# EasyEDA Pro project Easyhub.epro

# Schematic Schematic1
Board Name: Board1; Create Date: 2026-01-28; Page Name: P1; Project Name: EasyHub; Schematic Name: Schematic1; Update Date: 2026-01-28; Company: EasyEDA.com; Page Size: A4; Version: V1.0
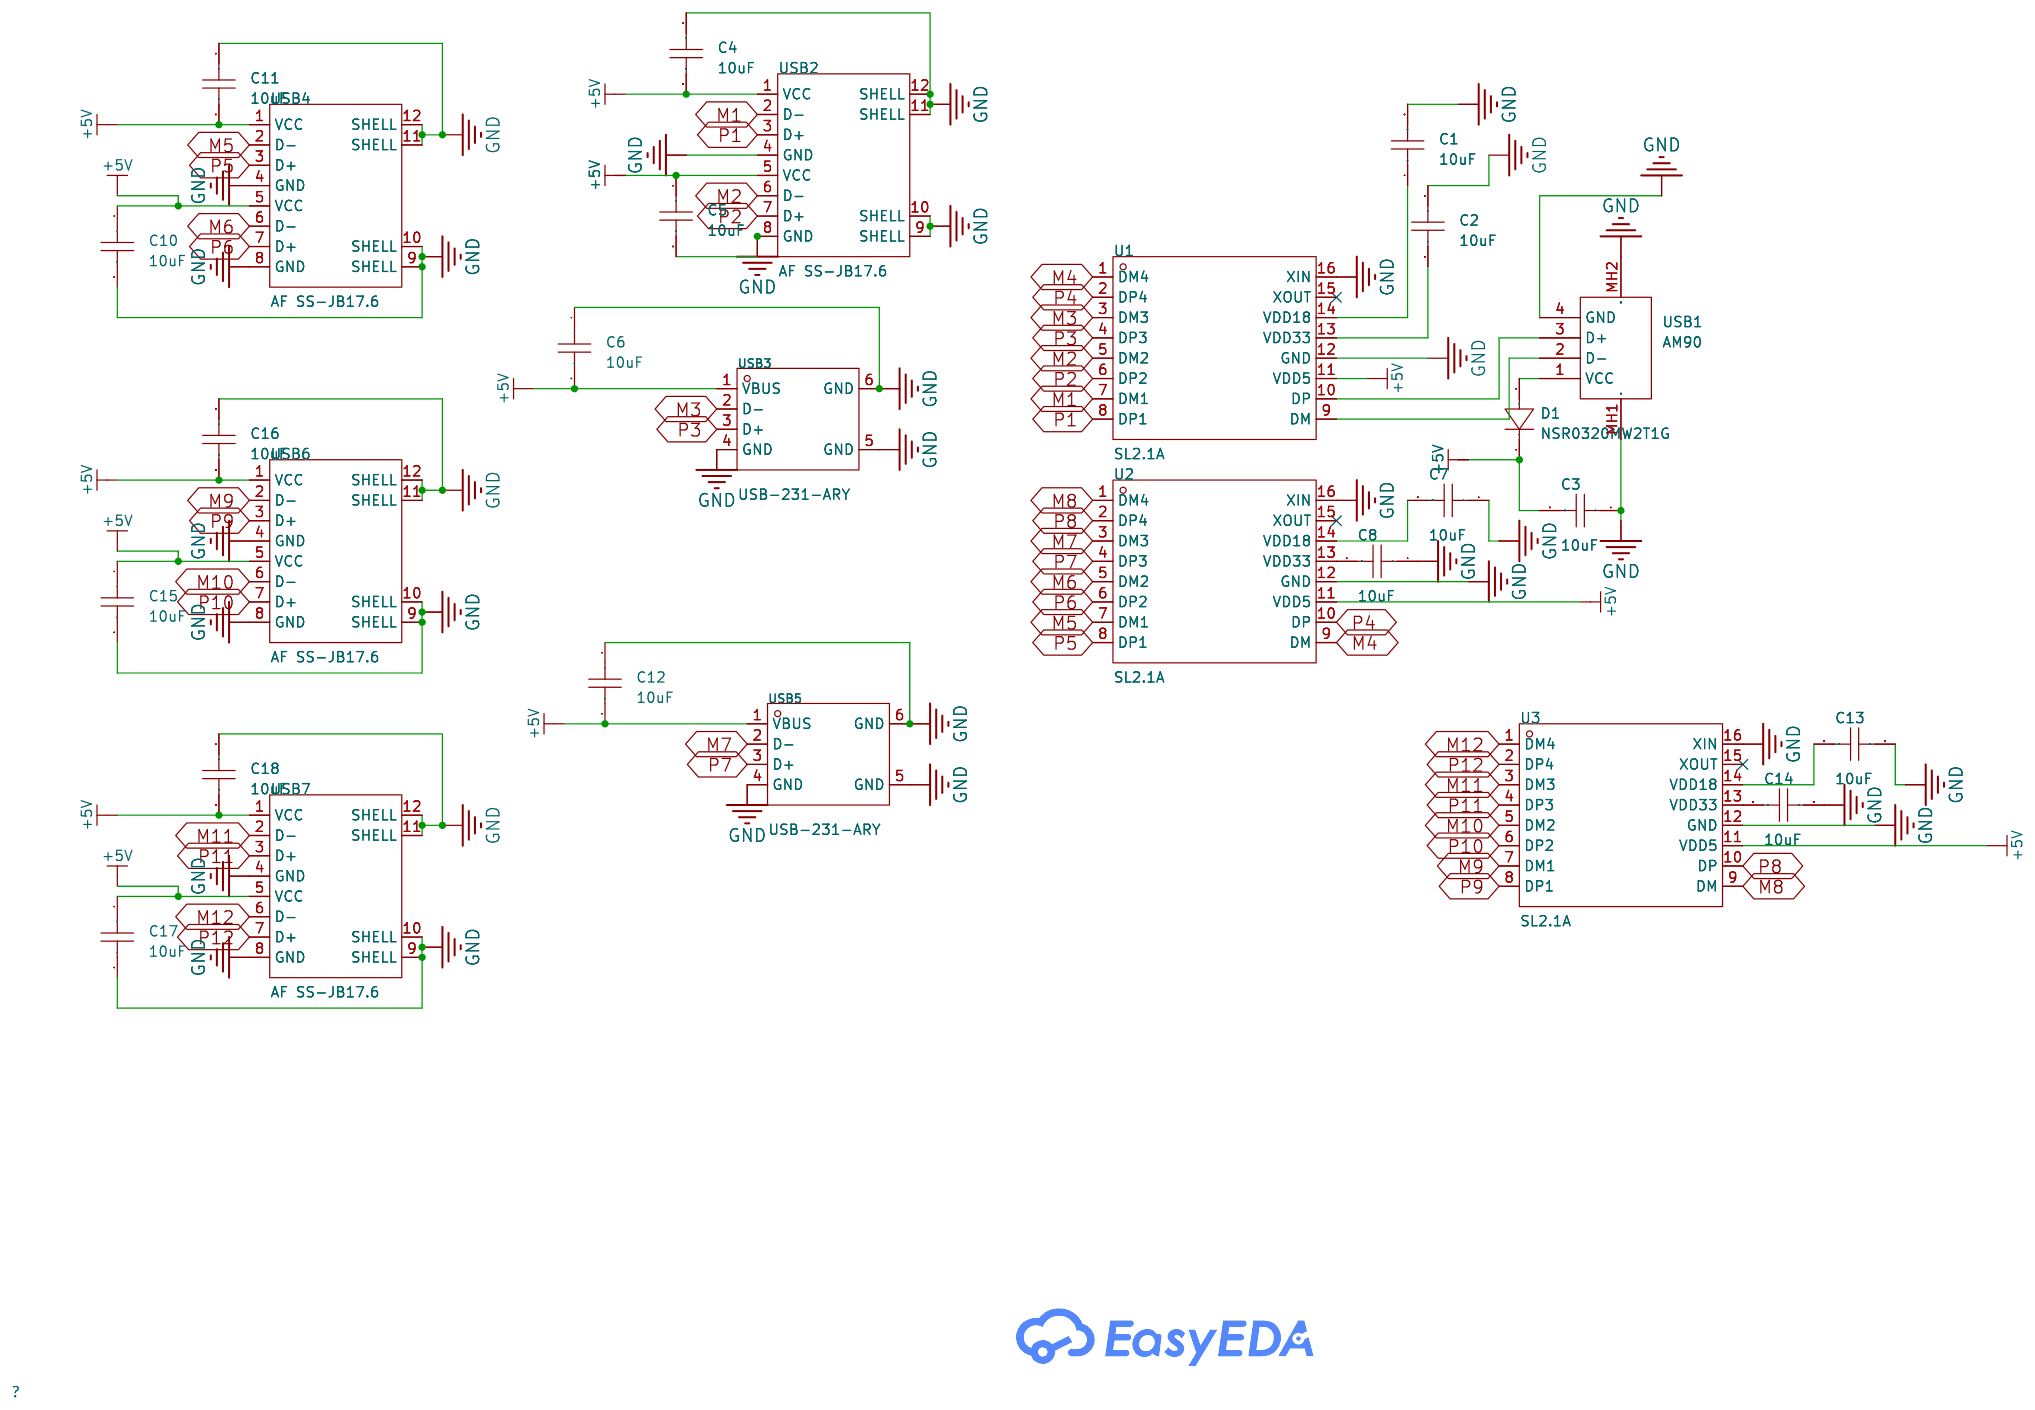
[diagram p0: schematic sheet]

## Parts
C1  10uF  [C0603]
C2  10uF  [C0603]
C3  10uF  [C0603]
C4  10uF  [C0603]
C5  10uF  [C0603]
C6  10uF  [C0603]
C7  10uF  [C0603]
C8  10uF  [C0603]
C10  10uF  [C0603]
C11  10uF  [C0603]
C12  10uF  [C0603]
C13  10uF  [C0603]
C14  10uF  [C0603]
C15  10uF  [C0603]
C16  10uF  [C0603]
C17  10uF  [C0603]
C18  10uF  [C0603]
D1  NSR0320MW2T1G  [SOD-323_L1.8-W1.3-LS2.5-RD]
U1  SL2.1A  [SOP-16_L10.0-W3.9-P1.27-LS6.0-BL]
U2  SL2.1A  [SOP-16_L10.0-W3.9-P1.27-LS6.0-BL]
U3  SL2.1A  [SOP-16_L10.0-W3.9-P1.27-LS6.0-BL]
USB1  AM90  [USB-AM-TH_AM90]
USB2  AF SS-JB17.6  [USB-A-TH_AF-SS-JB17.6]
USB3  USB-231-ARY  [USB-A-TH_USB-231-ARY]
USB4  AF SS-JB17.6  [USB-A-TH_AF-SS-JB17.6]
USB5  USB-231-ARY  [USB-A-TH_USB-231-ARY]
USB6  AF SS-JB17.6  [USB-A-TH_AF-SS-JB17.6]
USB7  AF SS-JB17.6  [USB-A-TH_AF-SS-JB17.6]

## Library data of the parts
C1-C8 C10-C18 = CL10A106KP8NNNC: Capacitance:10uF Tolerance:±10% Tolerance:±10% Voltage Rating:10V Temperature Coefficient:X5R; LCSC Part Name: 10uF ±10% 10V; Supplier Part: C19702; Manufacturer: SAMSUNG(三星); Supplier Footprint: 0603; JLCPCB Part Class: Basic Part; Datasheet: https://item.szlcsc.com/datasheet/CL10A106KP8NNNC/20411.html; Supplier: LCSC; Tolerance: ±10%; Voltage Rating: 10V; Temperature Coefficient: X5R
D1 = NSR0320MW2T1G: Voltage - Forward(Vf@If):500mV@900mA Voltage - DC Reverse(Vr):20V Current - Rectified:1A Reverse Leakage Current (Ir):50uA@15V Operating Junction Temperature Range:-55℃~+125℃ Operating Junction Temperature Range:-55℃~+125℃ Non-Repetitive Peak Forward Surg; LCSC Part Name: 电压:20V 电流:1A; Supplier Part: C48192; Manufacturer: onsemi(安森美); Supplier Footprint: SOD-323; JLCPCB Part Class: Extended Part; Datasheet: https://item.szlcsc.com/datasheet/NSR0320MW2T1G/49199.html; Supplier: LCSC; Voltage - Forward(Vf@If): 500mV@900mA; Voltage - DC Reverse(Vr): 20V; Current - Rectified: 1A; Reverse Leakage Current (Ir): 50uA@15V; Operating Junction Temperature Range: -55℃~+125℃; Non-Repetitive Peak Forward Surge Current: 5A
U1-U3 = SL2.1A_C6798314: Supplier Part: C6798314; Manufacturer: CoreChips(和芯润德); Supplier Footprint: SOP-16; JLCPCB Part Class: Extended Part; Datasheet: https://item.szlcsc.com/datasheet/SL2.1A/7757919.html; Supplier: LCSC
USB1 = AM90: Connector Type:Type-A Protocol Standard:USB 2.0 Gender:Male Mounting Type:Right Angle Number of Contacts:4P Number of Ports:1 Current Rating-Power:1.5A Voltage Rating:30V Connect-Disconnect Life:5,000 times Supplementary Features:- Center Height:- Length:; LCSC Part Name: Type-A弯插公头; Supplier Part: C404965; Manufacturer: SHOU HAN(首韩); Supplier Footprint: 弯插; JLCPCB Part Class: Extended Part; Datasheet: https://item.szlcsc.com/datasheet/AM90/392530.html; Supplier: LCSC; Connector Type: Type-A; Protocol Standard: USB 2.0; Gender: Male; Mounting Type: Right Angle; Number of Contacts: 4P; Number of Ports: 1; Current Rating-Power: 1.5A; Voltage Rating: 30V; Connect-Disconnect Life: 5,000 times; Length: 18.8mm; Detection color: White; Operating Temperature: -25℃~+85℃
USB2 USB4 USB6 USB7 = AF SS-JB17.6: Connector Type:Type-A Protocol Standard:USB 2.0 Gender:Female Mounting Type:Right Angle Number of Contacts:4Px2 Number of Ports:2 Current Rating-Power:1.5A Voltage Rating:30V Connect-Disconnect Life:5,000 times Supplementary Features:- Center Height:- Len; LCSC Part Name: Type-A弯插双层母座; Supplier Part: C456021; Manufacturer: SHOU HAN(首韩); Supplier Footprint: 弯插; JLCPCB Part Class: Extended Part; Datasheet: https://item.szlcsc.com/datasheet/AF%2520SS-JB17.6/458828.html; Supplier: LCSC; Connector Type: Type-A; Protocol Standard: USB 2.0; Gender: Female; Mounting Type: Right Angle; Number of Contacts: 4Px2; Number of Ports: 2; Current Rating-Power: 1.5A; Voltage Rating: 30V; Connect-Disconnect Life: 5,000 times; Length: 17.6mm; Detection color: White; Operating Temperature: -25℃~+85℃
USB3 USB5 = USB-231-ARY: Connector Type:Type-A Protocol Standard:USB 2.0 Gender:Female Mounting Type:Right Angle Number of Contacts:4P Number of Ports:1 Current Rating-Power:1.5A Voltage Rating:30V Length:14.2mm Detection color:White Operating Temperature:-20℃~+70℃ Operating Temp; LCSC Part Name: Type-A 母 弯插; Supplier Part: C720525; Manufacturer: XUNPU(讯普); Supplier Footprint: 弯插; JLCPCB Part Class: Extended Part; Datasheet: https://item.szlcsc.com/datasheet/USB-231-ARY/763532.html; Supplier: LCSC; Connector Type: Type-A; Protocol Standard: USB 2.0; Gender: Female; Mounting Type: Right Angle; Number of Contacts: 4P; Number of Ports: 1; Current Rating-Power: 1.5A; Voltage Rating: 30V; Length: 14.2mm; Detection color: White; Operating Temperature: -20℃~+70℃

## Nets
+5V: C3.2 C4.2 C5.1 C6.2 C10.1 C11.2 C12.2 C15.1 C16.2 C17.1 C18.2 D1.1(K) U1.11(VDD5) U2.11(VDD5) U3.11(VDD5) USB2.1(VCC) USB2.5(VCC) USB3.1(VBUS) USB4.1(VCC) USB4.5(VCC) USB5.1(VBUS) USB6.1(VCC) USB6.5(VCC) USB7.1(VCC) USB7.5(VCC)
GND: C1.2 C2.1 C3.1 C4.1 C5.2 C6.1 C7.1 C8.1 C10.2 C11.1 C12.1 C13.1 C14.1 C15.2 C16.1 C17.2 C18.1 U1.12(GND) U1.16(XIN) U2.12(GND) U2.16(XIN) U3.12(GND) U3.16(XIN) USB1.4(GND) USB1.MH1 USB1.MH2 USB2.4(GND) USB2.8(GND) USB2.9(SHELL) USB2.10(SHELL) USB2.11(SHELL) USB2.12(SHELL) USB3.4(GND) USB3.5(GND) USB3.6(GND) USB4.4(GND) USB4.8(GND) USB4.9(SHELL) USB4.10(SHELL) USB4.11(SHELL) USB4.12(SHELL) USB5.4(GND) USB5.5(GND) USB5.6(GND) USB6.4(GND) USB6.8(GND) USB6.9(SHELL) USB6.10(SHELL) USB6.11(SHELL) USB6.12(SHELL) USB7.4(GND) USB7.8(GND) USB7.9(SHELL) USB7.10(SHELL) USB7.11(SHELL) USB7.12(SHELL)
M1: U1.7(DM1) USB2.2(D-)
M2: U1.5(DM2) USB2.6(D-)
M3: U1.3(DM3) USB3.2(D-)
M4: U1.1(DM4) U2.9(DM)
M5: U2.7(DM1) USB4.2(D-)
M6: U2.5(DM2) USB4.6(D-)
M7: U2.3(DM3) USB5.2(D-)
M8: U2.1(DM4) U3.9(DM)
M9: U3.7(DM1) USB6.2(D-)
M10: U3.5(DM2) USB6.6(D-)
M11: U3.3(DM3) USB7.2(D-)
M12: U3.1(DM4) USB7.6(D-)
P1: U1.8(DP1) USB2.3(D+)
P2: U1.6(DP2) USB2.7(D+)
P3: U1.4(DP3) USB3.3(D+)
P4: U1.2(DP4) U2.10(DP)
P5: U2.8(DP1) USB4.3(D+)
P6: U2.6(DP2) USB4.7(D+)
P7: U2.4(DP3) USB5.3(D+)
P8: U2.2(DP4) U3.10(DP)
P9: U3.8(DP1) USB6.3(D+)
P10: U3.6(DP2) USB6.7(D+)
P11: U3.4(DP3) USB7.3(D+)
P12: U3.2(DP4) USB7.7(D+)
$1N764: U1.10(DP) USB1.3(D+)
$1N770: U1.9(DM) USB1.2(D-)
$1N1165: C1.1 U1.14(VDD18)
$1N1196: C2.2 U1.13(VDD33)
$1N1363: D1.2(A) USB1.1(VCC)
$1N2180: C7.2 U2.14(VDD18)
$1N2340: C8.2 U2.13(VDD33)
$1N5208: C14.2 U3.13(VDD33)
$1N5214: C13.2 U3.14(VDD18)

Not connected (* = marked no-connect by the designer): U1 15(XOUT)*; U2 15(XOUT)*; U3 15(XOUT)*

# Board PCB1
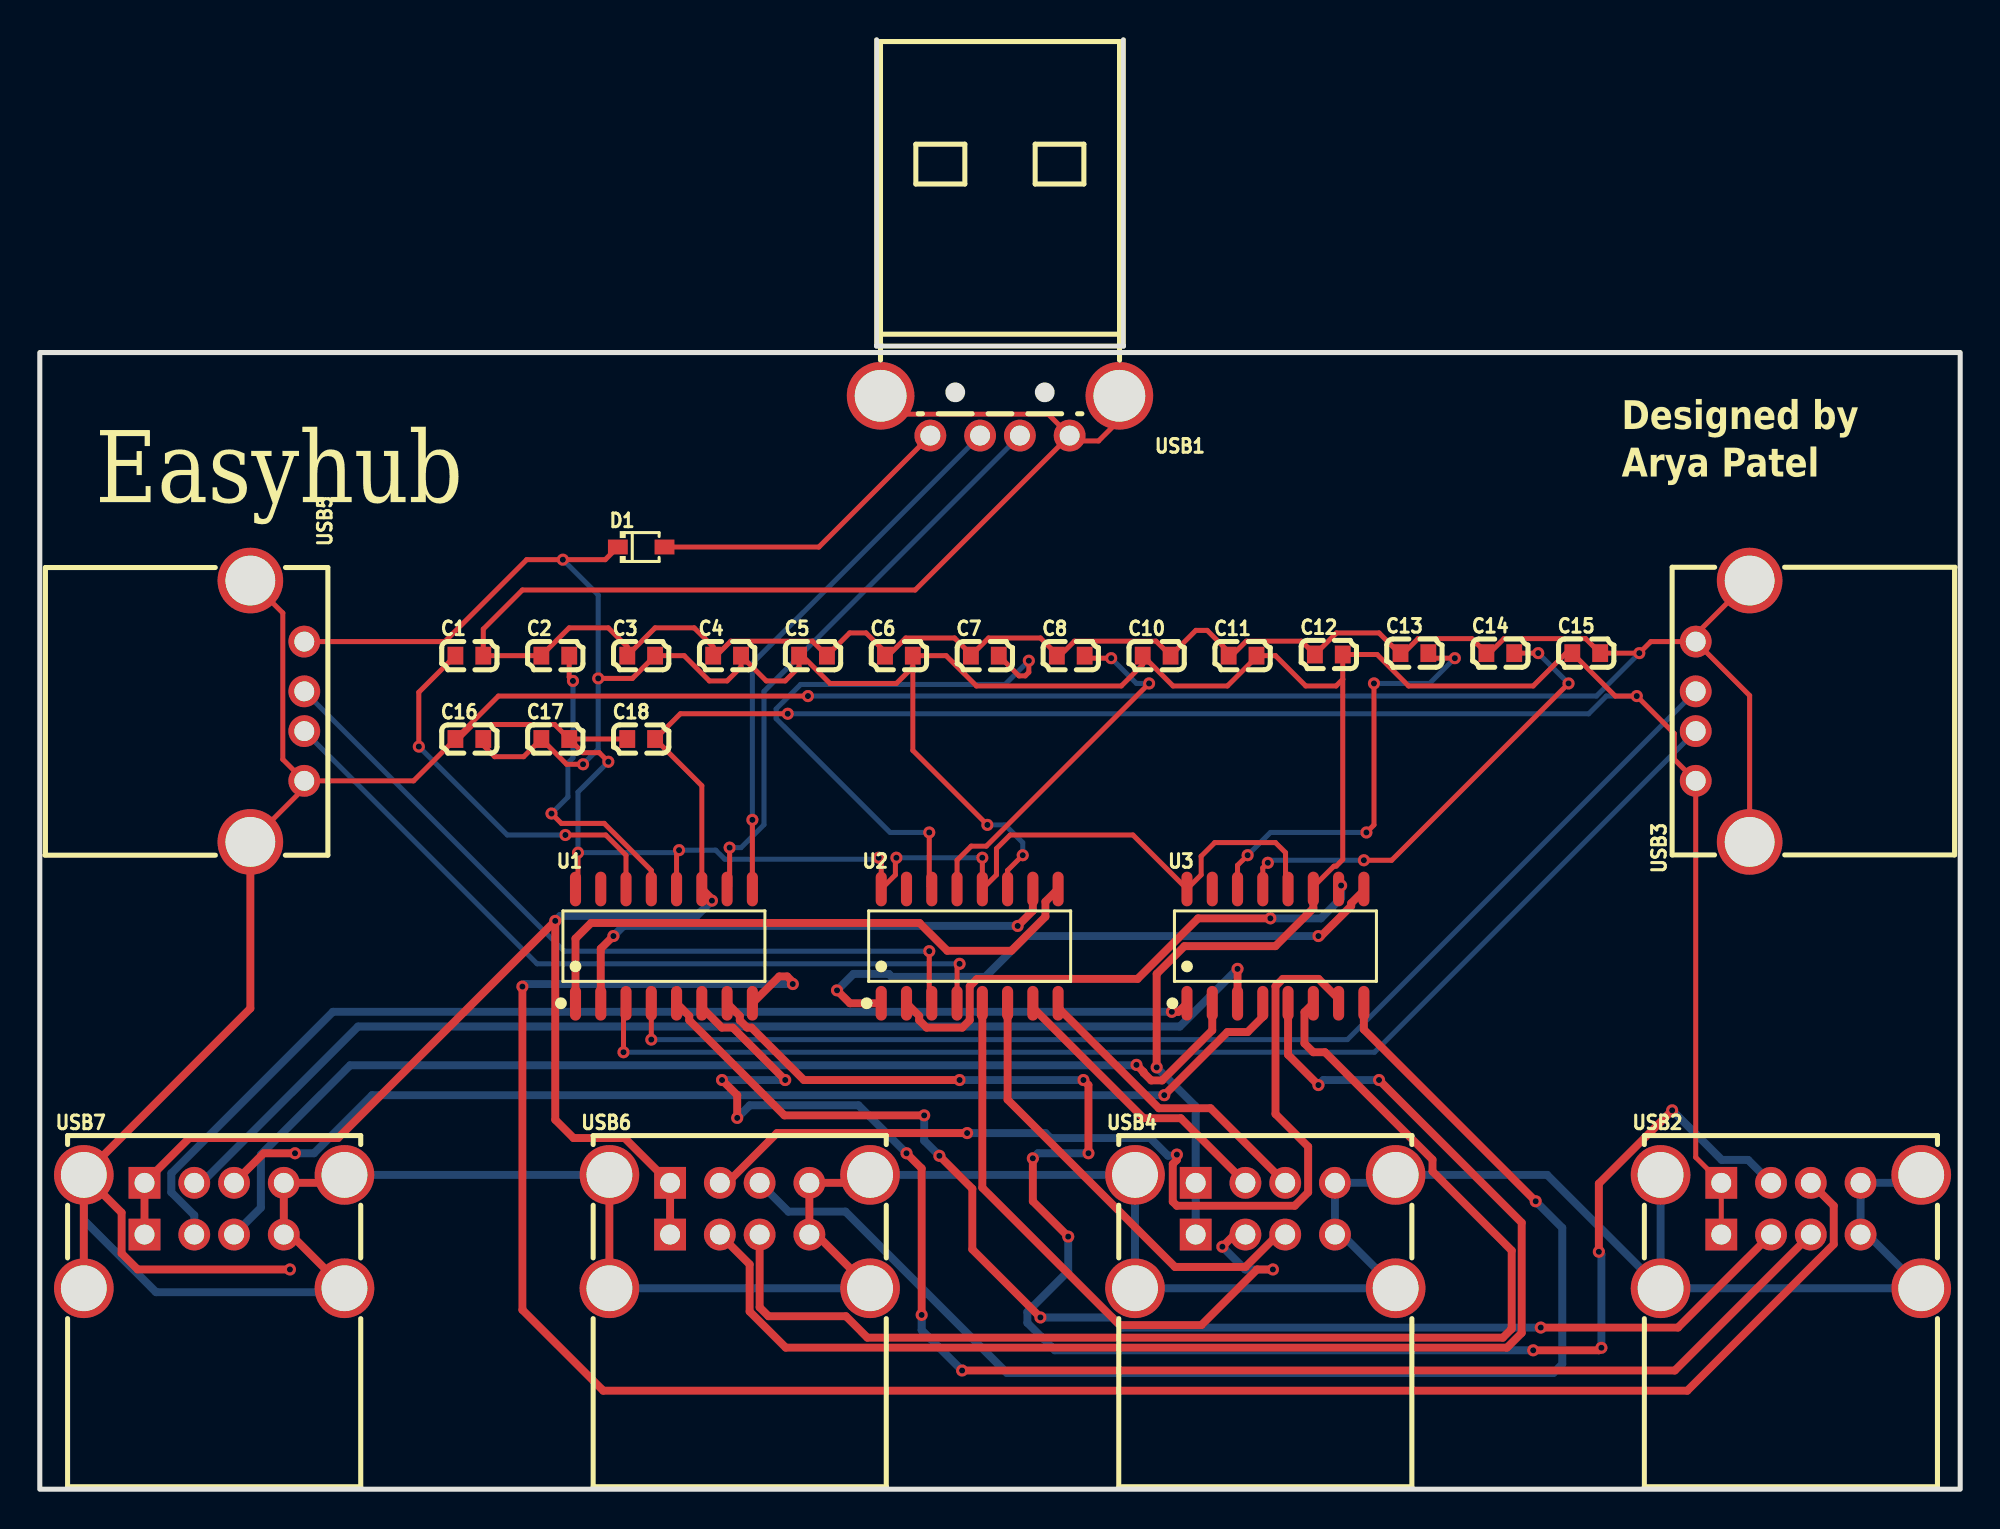
[diagram p1: board, top side]
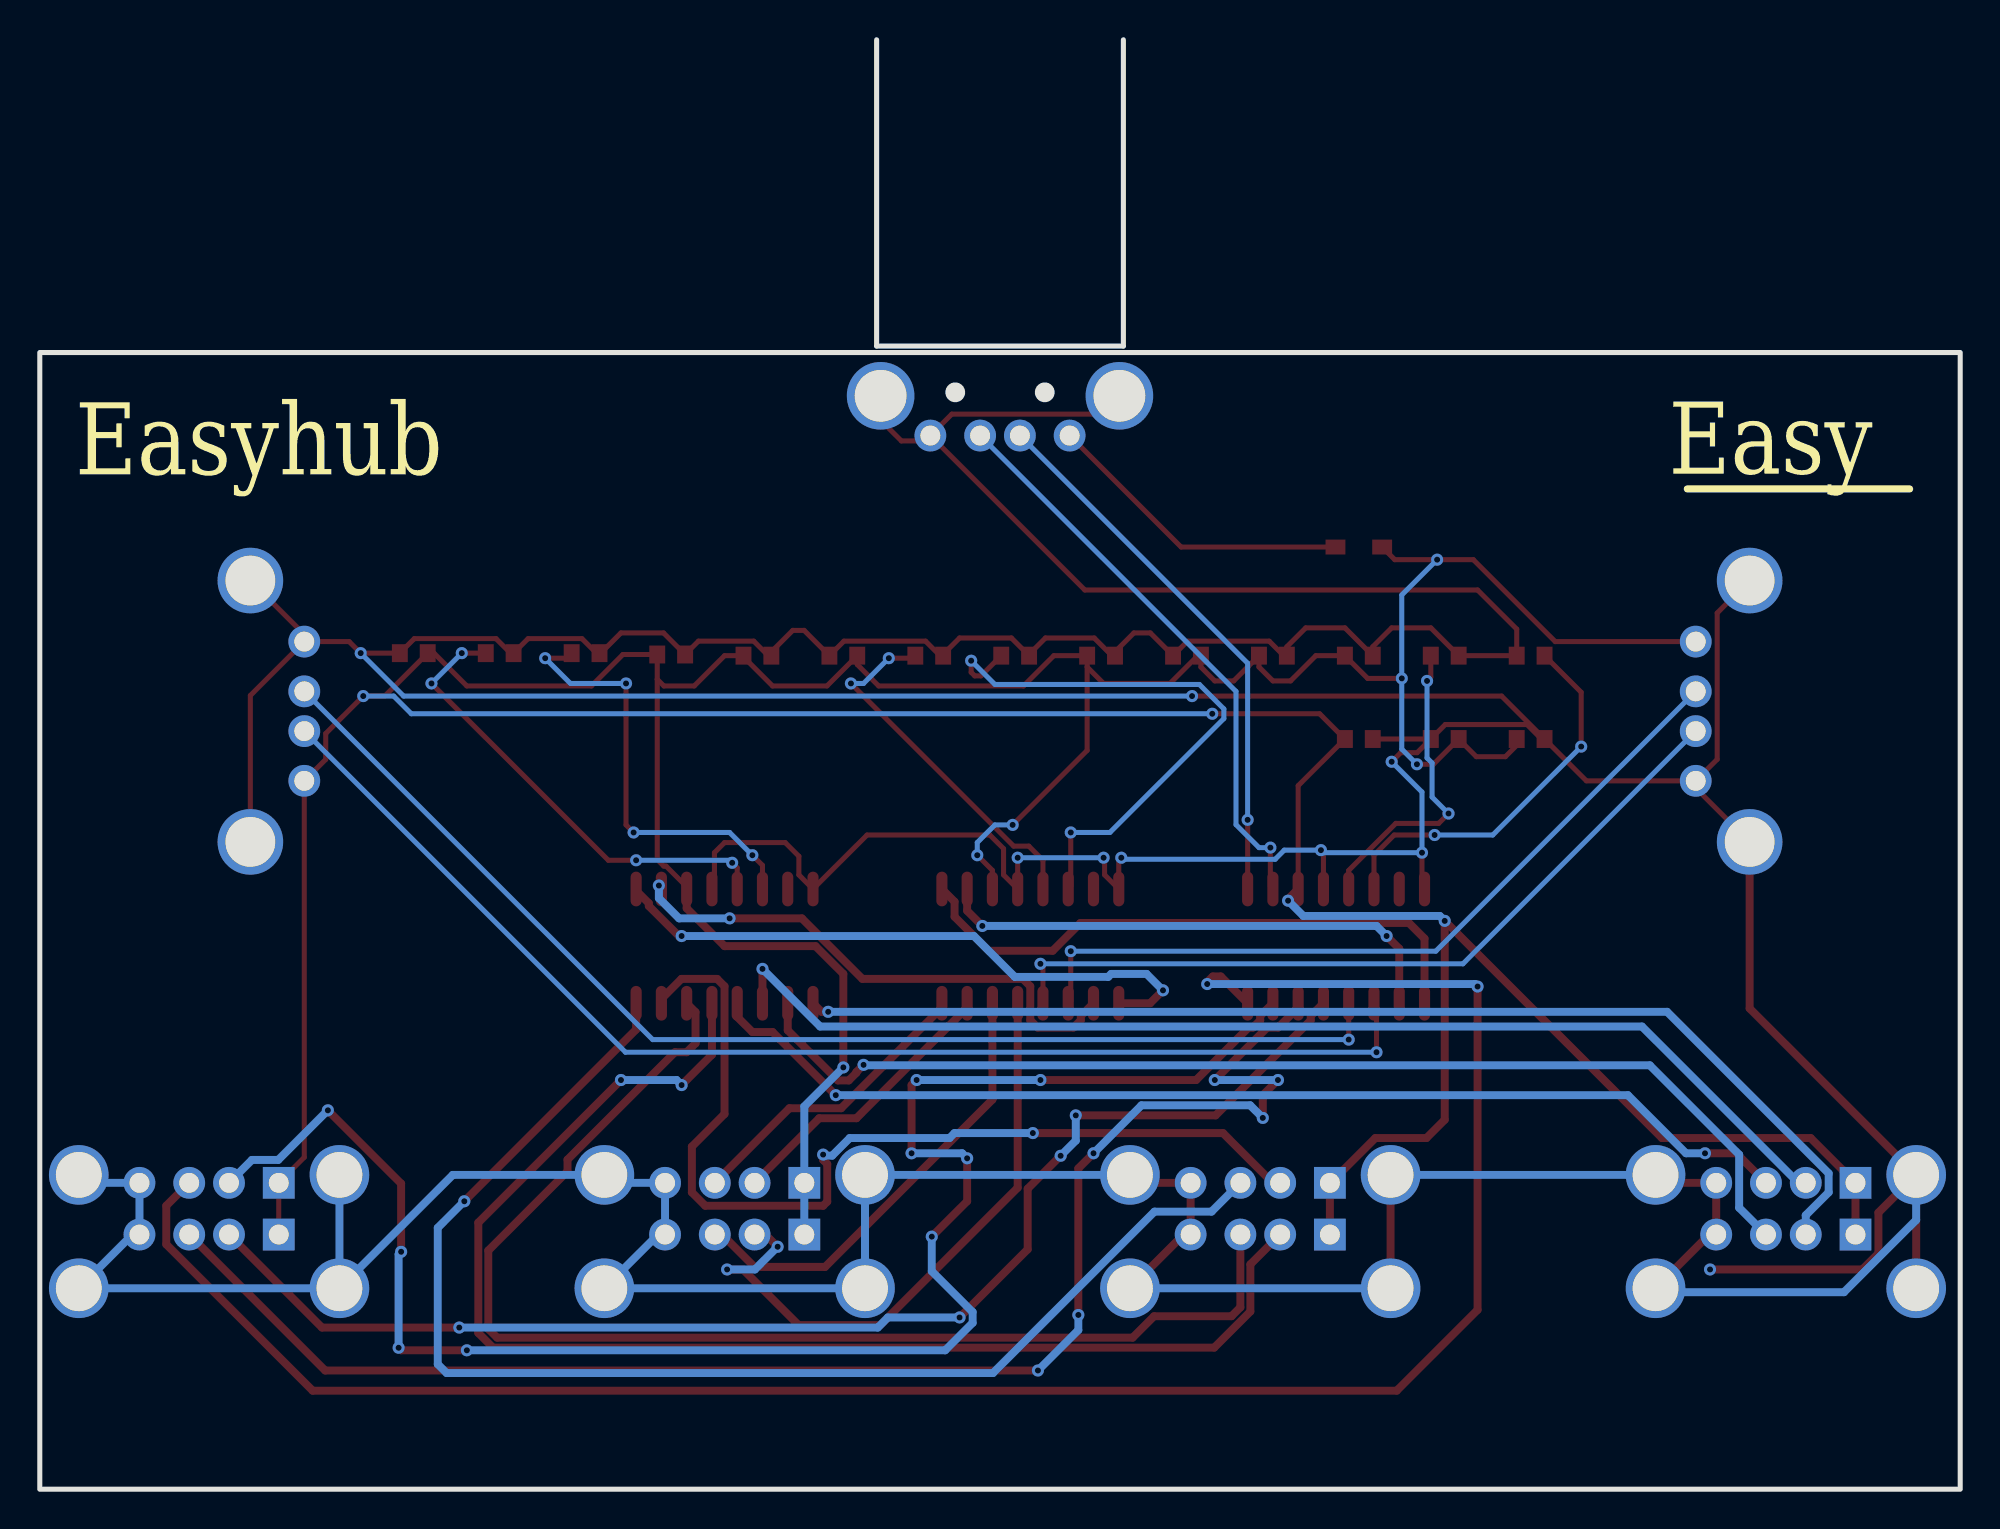
[diagram p2: board, bottom side, seen from below]

Outline 96.52 x 72.87 mm; copper layers: Top Layer, Bottom Layer. Coordinates in mm from the lower left corner of the outline.
Outline path: rectangle 0,57.15 96.52,0
Stack: Top Layer 0.035mm / Dielectric1 1.51mm FR4 er 4.5 / Bottom Layer 0.035mm

## Design rules (mm)
template: JLCPCB Capability(Two Layers Board)
spacing copperThickness1oz (default): track to track 0.102, other pairs 0.152 to 0.3
spacing copperThickness2oz: track to track 0.203, other pairs 0.152 to 0.3
track width copperThickness1oz (default): min 0.127, default 0.254, max 2.54
track width copperThickness2oz: min 0.203, default 0.254, max 2.54
differential pair differentialPair (default): width min 0.127, default 0.254, max 2.54; gap min 0.152, default 0.152
via viaSize (default): diameter min 0.5, default 0.61, max 10; hole min 0.3, default 0.305, max 6.3

## Placement (name value [footprint] x y rotation side)
C1  10uF  [C0603]  21.59 41.91 0 top
C2  10uF  [C0603]  25.91 41.91 0 top
C3  10uF  [C0603]  30.23 41.91 0 top
C4  10uF  [C0603]  34.54 41.91 0 top
C5  10uF  [C0603]  38.86 41.91 0 top
C6  10uF  [C0603]  43.18 41.91 0 top
C7  10uF  [C0603]  47.5 41.91 0 top
C8  10uF  [C0603]  51.82 41.91 0 top
C10  10uF  [C0603]  56.13 41.91 0 top
C11  10uF  [C0603]  60.45 41.91 0 top
C12  10uF  [C0603]  64.79 41.97 0 top
C13  10uF  [C0603]  69.09 42.04 0 top
C14  10uF  [C0603]  73.41 42.04 0 top
C15  10uF  [C0603]  77.72 42.04 0 top
C16  10uF  [C0603]  21.59 37.72 0 top
C17  10uF  [C0603]  25.91 37.72 0 top
C18  10uF  [C0603]  30.23 37.72 0 top
D1  NSR0320MW2T1G  [SOD-323_L1.8-W1.3-LS2.5-RD]  30.23 47.37 0 top
U1  SL2.1A  [SOP-16_L10.0-W3.9-P1.27-LS6.0-BL]  31.37 27.3 0 top
U2  SL2.1A  [SOP-16_L10.0-W3.9-P1.27-LS6.0-BL]  46.74 27.3 0 top
U3  SL2.1A  [SOP-16_L10.0-W3.9-P1.27-LS6.0-BL]  62.1 27.3 0 top
USB1  AM90  [USB-AM-TH_AM90]  48.26 53.97 180 top
USB2  AF SS-JB17.6  [USB-A-TH_AF-SS-JB17.6]  88.01 12.95 0 top
USB3  USB-231-ARY  [USB-A-TH_USB-231-ARY]  84.58 39.12 90 top
USB4  AF SS-JB17.6  [USB-A-TH_AF-SS-JB17.6]  61.59 12.95 0 top
USB5  USB-231-ARY  [USB-A-TH_USB-231-ARY]  11.94 39.12 270 top
USB6  AF SS-JB17.6  [USB-A-TH_AF-SS-JB17.6]  35.18 12.95 0 top
USB7  AF SS-JB17.6  [USB-A-TH_AF-SS-JB17.6]  8.76 12.95 0 top

## Footprints (pads in the part's own frame, mm; a bottom-side part is the same pattern mirrored in y, then rotated)
C0603
  rect 0.8x0.9 smd: 1(-0.7,0) 2(0.7,0)
SOD-323_L1.8-W1.3-LS2.5-RD
  rect 1x0.75 smd: 1(-1.173,0) 2(1.173,0)
SOP-16_L10.0-W3.9-P1.27-LS6.0-BL
  oval 0.56x1.745 smd: 1(-4.445,-2.873) 2(-3.175,-2.873) 3(-1.905,-2.873) 4(-0.635,-2.873) 5(0.635,-2.873) 6(1.905,-2.873) 7(3.175,-2.873) 8(4.445,-2.873) 9(4.445,2.873) 10(3.175,2.873) 11(1.905,2.873) 12(0.635,2.873) 13(-0.635,2.873) 14(-1.905,2.873) 15(-3.175,2.873) 16(-4.445,2.873)
USB-A-TH_AF-SS-JB17.6
  rect 1.6x1.6 hole 1: 1(-3.5,2.45) 5(-3.5,-0.15)
  round 1.6 hole 1: 2(-1,2.45) 3(1,2.45) 4(3.5,2.45) 6(-1,-0.15) 7(1,-0.15) 8(3.5,-0.15)
  round 3 hole 2.3: 9(-6.55,2.85) 10(6.55,2.85) 11(-6.55,-2.85) 12(6.55,-2.85)
USB-A-TH_USB-231-ARY
  round 1.6 hole 1: 1(-3.5,1.355) 2(-1,1.355) 3(1,1.355) 4(3.5,1.355)
  round 3.3 hole 2.5: 5(-6.57,-1.355) 6(6.57,-1.355)
USB-AM-TH_AM90
  round 1.6 hole 1: 1(3.5,1) 2(1,1) 3(-1,1) 4(-3.5,1)
  round 3.4 hole 2.6: MH1(6,-1) MH2(-6,-1)

## Nets
As in the schematic.

Pads without a net: U1 15; U2 15; U3 15

## Via types
v1: diameter 0.61, hole 0.305, Top Layer to Bottom Layer, 80 vias

## Routing (per net, layer and track width the routed paths; a pad name or vN(x,y) marks a point on that pad's centre or on a via; arc(x,y) is an arc through that point)
+5V: length 294.2
  Top Layer w0.254: v1(27.31,36.45) 26.48,36.45 C17.1 24.32,36.83 22.86,36.83 22.29,37.4 C16.2 ; v1(49.4,31.88) 48.64,31.11 48.64,30.18 ; 43.88,41.34 C6.2 45.55,41.91 47.08,40.39 54.36,40.39 55.43,41.46 C10.1 56.96,40.39 59.69,40.39 61.15,41.85 C11.2 62.1,41.91 63.63,40.39 65.15,40.39 65.49,40.72 ; 43.88,41.34 43.05,40.51 39.71,40.51 38.32,41.91 C5.1 38.16,41.34 37.47,40.64 36.51,40.64 C4.2 35.24,41.34 34.54,40.64 33.66,40.64 32.38,41.91 C3.2 29.78,40.77 v1(28.07,40.77) ; 43.88,41.34 43.88,37.15 v1(47.62,33.4) ; U1.11 33.27,35.37 C18.2 32.2,38.99 v1(37.59,38.99) ; 65.49,40.72 65.49,41.97 67.21,41.97 68.79,40.39 75.06,40.39 76.71,42.04 C15.1 79.18,39.88 v1(80.26,39.88) 82.15,37.99 82.15,36.69 USB3.1 83.23,16.69 84.51,15.4 USB2.5 ; 65.49,40.72 65.49,31.66 65.16,31.33 65.05,31.33 64.01,30.29 U3.11 ; USB5.1 20.35,42.62 24.47,46.74 v1(26.29,46.74) 28.42,46.74 D1.1
  Top Layer w0.4: U1.11 33.78,29.67 v1(33.78,29.59) ; v1(56.13,21.21) 56.13,25.91 57.53,27.3 62.1,27.3 64.01,29.21 U3.11 ; USB6.5 31.68,15.37 29.4,17.66 26.83,17.66 25.91,18.57 v1(25.91,28.57) 14.99,17.66 7.52,17.66 5.26,15.4 USB7.5
  Bottom Layer w0.254: v1(37.59,38.99) 77.85,38.99 78.74,39.88 v1(80.26,39.88) ; v1(26.29,46.74) 28.07,44.96 v1(28.07,40.77) 28.07,37.21 v1(27.31,36.45) ; v1(49.4,31.88) 49.4,32.51 48.51,33.4 v1(47.62,33.4)
  Bottom Layer w0.4: v1(33.78,29.59) 33.01,28.82 26.16,28.82 v1(25.91,28.57) ; USB4.5 58.09,19.25 v1(56.13,21.21)
GND: length 483.5
  Top Layer w0.254: C17.2 C18.1 ; C17.2 25.88,38.45 21.77,38.45 21.05,37.72 C16.1 ; C17.2 27.29,37.03 28.12,37.03 v1(28.58,36.58) ; 85.94,45.69 83.23,42.98 USB3.4 ; C16.1 23.05,39.88 v1(38.61,39.88) ; C16.1 18.79,35.62 USB5.4 ; USB5.4 13.29,35.26 USB5.6 ; USB5.4 12.21,36.69 12.21,44.05 10.58,45.69 ; USB1.MH2 54.26,53.75 53.21,52.7 52.03,52.7 USB1.4 ; USB1.MH1 43.18,54.05 50.68,54.05 USB1.4 ; USB1.4 44,45.21 24.26,45.21 22.29,43.24 C1.2 C2.1 26.61,43.31 28.58,43.31 29.53,42.36 C3.1 30.92,43.31 32.89,43.31 33.84,42.36 C4.1 34,41.91 34.73,42.64 38.83,42.64 C5.2 40.71,43.05 41.53,43.05 42.48,42.1 C6.1 42.64,41.91 43.52,42.8 45.97,42.8 46.8,41.97 C7.1 47.69,42.8 50.29,42.8 51.12,41.97 C8.1 51.27,41.91 52,42.64 56.11,42.64 C10.2 58.1,43.18 58.67,43.18 59.75,42.1 C11.1 59.81,41.97 59.97,41.97 60.64,42.64 63.42,42.64 C12.1 65.17,43.05 67.31,43.05 68.33,42.04 C13.1 68.54,42.04 69.27,42.77 71.98,42.77 C14.1 72.86,42.04 73.59,42.77 77.69,42.77 C15.2 v1(80.39,42.04) 80.97,42.62 USB3.4 ; USB3.4 85.94,39.91 USB3.5 ; v1(43.05,31.75) 43,31.7 43,30.89 U2.16 42.29,31.62 v1(42.16,31.75) ; U1.12 32,32 v1(32.13,32.13) ; U1.16 27.05,30.3 v1(27.05,32) ; U3.12 62.61,30.3 62.61,32 62.1,32.51 59.06,32.51 58.37,31.83 58.37,30.89 U3.16 54.94,32.89 48.77,32.89 48.08,32.21 48.08,30.89 U2.12 v1(47.37,31.75)
  Top Layer w0.4: USB6.11 USB6.9 ; USB7.9 4.11,13.91 4.11,11.86 4.92,11.05 v1(12.57,11.05) ; USB7.9 USB7.11 ; USB7.9 10.58,24.17 USB5.6 ; USB6.12 39.03,12.8 USB6.8 38.68,15.4 41.33,15.4 USB6.10 ; USB7.12 12.26,13.15 12.26,15.4 14.91,15.4 USB7.10
  Bottom Layer w0.254: v1(80.39,42.04) 78.23,39.88 v1(38.61,39.88) ; v1(28.58,36.58) 27.05,35.05 v1(27.05,32) 32,32 v1(32.13,32.13) 33.97,32.13 34.43,31.67 42.09,31.67 v1(42.16,31.75) ; v1(43.05,31.75) v1(47.37,31.75)
  Bottom Layer w0.4: USB2.11 USB2.12 91.51,13.15 91.51,15.4 94.16,15.4 USB2.10 ; USB2.11 USB2.9 ; USB2.11 75.76,15.8 USB4.10 67.75,15.4 65.09,15.4 65.09,13.15 USB4.12 USB4.11 USB4.9 USB6.10 ; USB7.12 15.12,9.91 5.84,9.91 2.21,13.53 USB7.9 ; USB6.11 USB6.12 ; USB7.10 USB6.9
M1: length 85.6
  Top Layer w0.4: v1(82.04,19.05) 78.36,15.37 v1(78.36,11.94) ; U1.7 35.18,23.79 35.18,23.58 35.55,23.21 35.77,23.21 38.4,20.57 v1(46.23,20.57) ; v1(49.91,16.64) 49.91,14.48 v1(51.69,12.7) ; v1(78.49,7.11) 78.36,6.98 v1(75.06,6.98) ; v1(52.71,16.89) 52.71,20.32 v1(52.45,20.57)
  Bottom Layer w0.4: v1(75.06,6.98) 51.01,6.98 49.63,8.36 49.63,8.91 51.69,10.96 v1(51.69,12.7) ; 87.01,15.4 85.86,16.56 84.54,16.56 v1(82.04,19.05) ; v1(52.71,16.89) 50.16,16.89 v1(49.91,16.64) ; v1(78.36,11.94) 78.49,11.81 v1(78.49,7.11) ; v1(46.23,20.57) v1(52.45,20.57)
M2: length 66.4
  Top Layer w0.4: v1(44.45,18.8) 37.42,18.8 32.64,23.58 32.64,23.79 U1.5 ; USB2.6 82.34,8.13 v1(75.44,8.13) ; v1(50.29,8.64) 46.87,12.06 46.87,15.11 v1(45.21,16.76)
  Bottom Layer w0.4: v1(45.21,16.76) 44.45,17.53 v1(44.45,18.8) ; v1(50.29,8.64) 53.89,8.64 54.4,8.13 v1(75.44,8.13)
M3: length 63.1
  Top Layer w0.254: U1.3 29.34,24.31 v1(29.34,21.97)
  Bottom Layer w0.254: USB3.2 67.08,21.97 v1(29.34,21.97)
M4: length 30.1
  Top Layer w0.4: U1.1 26.92,27.69 27.71,28.47 44.21,28.47 45.61,27.07 48.83,27.07 50.54,28.79 50.54,29.54 U2.9
M5: length 14.6
  Top Layer w0.4: 60.59,15.4 57.35,18.65 55.47,18.65 49.91,24.22 U2.7
M6: length 32.3
  Top Layer w0.4: USB4.6 60.05,12.8 v1(59.44,12.19) ; U2.5 47.37,15.16 54.28,8.25 58.38,8.25 61.18,11.05 v1(61.98,11.05)
  Bottom Layer w0.4: v1(59.44,12.19) 60.58,11.05 v1(61.98,11.05)
M7: length 39.5
  Top Layer w0.254: U2.3 44.7,24.56 v1(44.7,27.05)
  Bottom Layer w0.254: USB5.2 26.36,27.05 v1(44.7,27.05)
M8: length 31.3
  Top Layer w0.4: U2.1 40.72,24.43 v1(40.07,25.08) ; v1(64.26,27.81) 64.4,27.81 65.91,29.32 65.91,29.46 66.55,30.1 U3.9
  Bottom Layer w0.4: v1(64.26,27.81) 49.57,27.81 47.52,25.76 42.82,25.76 42.67,25.91 40.89,25.91 v1(40.07,25.08)
M9: length 49.1
  Top Layer w0.4: U3.7 65.28,24.65 64.27,25.66 62.48,25.66 62.11,25.29 62.11,18.87 63.75,17.22 63.75,14.93 63.07,14.25 57.15,14.25 56.94,14.46 56.94,16.35 57.15,16.56 v1(57.15,16.82) ; 34.18,15.4 34.55,15.4 37.05,17.91 v1(46.61,17.91)
  Bottom Layer w0.4: v1(57.15,16.82) 57.1,16.77 56.7,16.77 55.81,17.66 50.8,17.66 50.55,17.91 v1(46.61,17.91)
M10: length 67.9
  Top Layer w0.4: v1(67.31,20.57) 74.48,13.4 74.48,7.86 73.74,7.12 37.5,7.12 35.68,8.94 35.68,11.31 USB6.6 ; v1(64.26,20.32) 62.74,21.84 U3.5
  Bottom Layer w0.4: v1(67.31,20.57) 64.52,20.57 v1(64.26,20.32)
M11: length 58.6
  Top Layer w0.4: v1(60.2,26.16) U3.3
  Bottom Layer w0.4: 7.76,15.4 8.13,15.4 15.99,23.26 57.3,23.26 v1(60.2,26.16)
M12: length 58.1
  Top Layer w0.4: U3.1 57.23,24 v1(56.9,24)
  Bottom Layer w0.4: USB7.6 7.76,13.77 6.61,14.93 6.61,15.88 14.73,24 v1(56.9,24)
P1: length 106.9
  Top Layer w0.4: v1(37.85,25.4) 37.85,25.5 37.56,25.78 37.16,25.78 U1.8 ; v1(24.26,25.27) 24.26,9.02 28.32,4.95 82.8,4.95 90.16,12.31 90.16,14.25 89.01,15.4
  Bottom Layer w0.4: v1(24.26,25.27) 24.38,25.4 v1(37.85,25.4)
P2: length 78.6
  Top Layer w0.4: v1(37.47,20.57) 34.83,23.21 34.28,23.21 33.27,24.22 U1.6 ; v1(43.56,16.89) 44.32,16.13 v1(44.32,8.76) ; v1(35.05,18.67) 35.05,19.81 v1(34.29,20.57) ; v1(46.36,5.97) 82.18,5.97 USB2.7
  Bottom Layer w0.4: v1(35.05,18.67) 35.69,19.3 41.15,19.3 v1(43.56,16.89) ; v1(34.29,20.57) v1(37.47,20.57) ; v1(46.36,5.97) 44.32,8 v1(44.32,8.76)
P3: length 61.6
  Top Layer w0.254: v1(30.73,22.61) U1.4
  Bottom Layer w0.254: v1(30.73,22.61) 65.72,22.61 USB3.3
P4: length 26.3
  Top Layer w0.4: U2.10 49.91,29.08 v1(49.15,28.32) ; v1(28.83,27.81) 28.19,27.18 U1.2
  Bottom Layer w0.4: v1(28.83,27.81) 29.34,28.32 v1(49.15,28.32)
P5: length 15.3
  Top Layer w0.4: 62.59,15.4 58.84,19.15 56.24,19.15 51.18,24.22 U2.8
P6: length 23
  Top Layer w0.4: USB4.7 62.22,12.8 60.6,11.18 57.05,11.18 48.64,19.59 48.64,24.43
P7: length 39.8
  Top Layer w0.254: 46.1,24.43 46.1,26.29 v1(46.23,26.42)
  Bottom Layer w0.254: USB5.3 24.99,26.42 v1(46.23,26.42)
P8: length 27
  Top Layer w0.4: U2.2 44.2,23.79 44.2,23.58 44.57,23.21 46.36,23.21 46.74,23.58 46.74,25.29 47.11,25.66 55.17,25.66 58.22,28.7 v1(61.85,28.7) ; U3.10 65.28,30.23 v1(65.41,30.35)
  Bottom Layer w0.4: v1(65.41,30.35) 65.41,29.72 64.39,28.7 v1(61.85,28.7)
P9: length 66.8
  Top Layer w0.4: v1(75.18,14.48) 66.55,23.11 U3.8
  Bottom Layer w0.4: v1(75.18,14.48) 76.52,13.14 76.52,6.29 76.07,5.84 48.61,5.84 40.5,13.96 37.63,13.96 36.18,15.4
P10: length 63.5
  Top Layer w0.4: USB6.7 36.18,9.14 36.62,8.7 40.52,8.7 41.59,7.62 73.53,7.62 73.98,8.07 73.98,12 70,15.98 70,16.57 64.6,21.97 64.01,21.97 63.56,22.42 63.56,23.99 U3.6
P11: length 55.8
  Top Layer w0.4: 9.76,15.4 11.25,16.89 v1(12.83,16.89) ; U3.4 61.47,23.75 60.71,22.99 59.69,22.99 v1(56.52,19.81)
  Bottom Layer w0.4: v1(56.52,19.81) 16.7,19.81 13.78,16.89 v1(12.83,16.89)
P12: length 57
  Top Layer w0.4: U3.2 58.93,23.07 56.41,20.55 55.86,20.55 55.48,20.94 55.48,20.98 v1(55.12,21.34)
  Bottom Layer w0.4: USB7.7 11.11,14.15 11.11,16.83 15.6,21.31 55.1,21.31 v1(55.12,21.34)
$1N764: length 29.2
  Top Layer w0.254: v1(34.67,32.26) 34.67,30.3 U1.10
  Bottom Layer w0.254: USB1.3 36.4,40.11 36.4,33.41 35.24,32.26 v1(34.67,32.26)
$1N770: length 27.5
  Top Layer w0.254: v1(35.81,33.65) U1.9
  Bottom Layer w0.254: v1(35.81,33.65) 35.81,41.53 USB1.2
$1N1165: length 19.7
  Top Layer w0.254: U1.14 29.46,31.88 28.45,32.89 v1(26.42,32.89) ; C1.1 19.05,40.07 v1(19.05,37.34)
  Bottom Layer w0.254: v1(26.42,32.89) 23.5,32.89 v1(19.05,37.34)
$1N1196: length 15.6
  Top Layer w0.254: v1(26.8,40.64) 26.61,40.83 C2.2 ; U1.13 30.73,31.11 28.37,33.48 26.21,33.48 v1(25.72,33.97)
  Bottom Layer w0.254: v1(25.72,33.97) 26.54,34.8 26.54,36.51 26.8,36.77 v1(26.8,40.64)
$1N1363: length 15.7
  Top Layer w0.254: USB1.1 39.16,47.37 D1.2
$1N2180: length 29.7
  Top Layer w0.254: v1(44.7,33.02) 44.7,30.3 U2.14 ; v1(49.71,41.66) 49.71,41.07 49.53,40.89 49.21,40.89 C7.2
  Bottom Layer w0.254: v1(44.7,33.02) 42.74,33.02 37.01,38.75 37.01,39.23 38.24,40.46 48.52,40.46 v1(49.71,41.66)
$1N2340: length 18.6
  Top Layer w0.254: v1(55.75,40.51) 47.57,32.33 46.81,32.33 46.1,31.62 46.1,30.18 ; v1(53.85,41.78) 52.64,41.78 C8.2
  Bottom Layer w0.254: v1(53.85,41.78) 55.12,40.51 v1(55.75,40.51)
$1N5208: length 23.6
  Top Layer w0.254: U3.13 61.47,31.24 v1(61.72,31.5) ; C14.2 v1(75.31,42.04) ; v1(76.84,40.51) 67.94,31.62 v1(66.55,31.62)
  Bottom Layer w0.254: v1(61.72,31.5) 61.85,31.62 v1(66.55,31.62) ; v1(75.31,42.04) v1(76.84,40.51)
$1N5214: length 22
  Top Layer w0.254: v1(60.71,31.88) 60.2,31.37 U3.14 ; v1(71.12,41.78) 70.04,41.78 C13.2 ; v1(67.06,40.51) 67.06,33.4 v1(66.68,33.02)
  Bottom Layer w0.254: v1(60.71,31.88) 61.85,33.02 v1(66.68,33.02) ; v1(67.06,40.51) 69.85,40.51 v1(71.12,41.78)

## Text on the board
Bottom Silkscreen Layer: Easy | Easyhub
Top Silkscreen Layer: Designed by / Arya Patel | Easyhub
